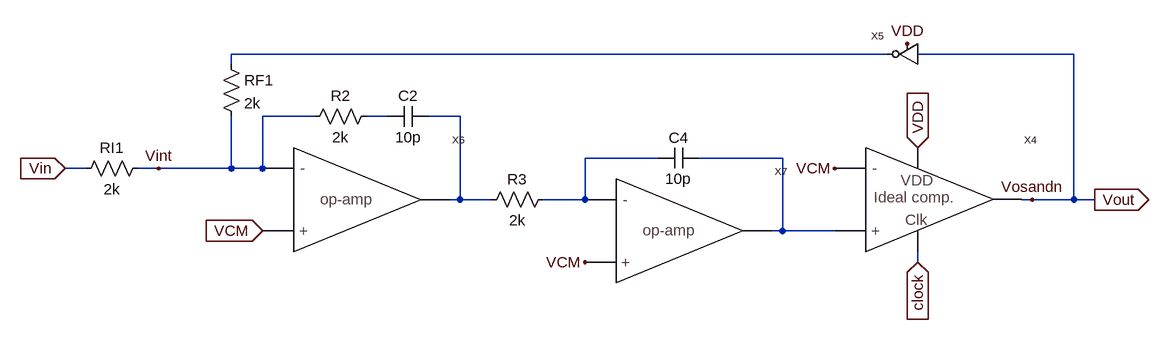
[diagram p0: schematic 1_bit_2nd_ANS_mod_MSD.asc]
1_bit_2nd_ANS_mod_MSD.asc, the LTspice schematic file:
Version 4
SHEET 1 912 680
WIRE 384 -720 -624 -720
WIRE 672 -720 432 -720
WIRE -624 -704 -624 -720
WIRE -496 -624 -576 -624
WIRE -384 -624 -416 -624
WIRE -272 -624 -320 -624
WIRE 32 -560 -80 -560
WIRE 224 -560 96 -560
WIRE -848 -544 -880 -544
WIRE -736 -544 -768 -544
WIRE -624 -544 -624 -624
WIRE -624 -544 -736 -544
WIRE -576 -544 -576 -624
WIRE -576 -544 -624 -544
WIRE -272 -496 -272 -624
WIRE -272 -496 -288 -496
WIRE -224 -496 -272 -496
WIRE -80 -496 -80 -560
WIRE -80 -496 -144 -496
WIRE 608 -496 592 -496
WIRE 672 -496 672 -720
WIRE 672 -496 608 -496
WIRE 704 -496 672 -496
WIRE 224 -448 224 -560
WIRE 224 -448 208 -448
WIRE 304 -448 224 -448
WIRE 432 -400 432 -416
FLAG 432 -576 VDD
IOPIN 432 -576 In
FLAG 432 -400 clock
IOPIN 432 -400 In
FLAG 704 -496 Vout
IOPIN 704 -496 Out
FLAG -880 -544 Vin
IOPIN -880 -544 In
FLAG -576 -448 VCM
IOPIN -576 -448 In
FLAG 608 -496 Vosandn
FLAG -736 -544 Vint
FLAG 304 -544 VCM
FLAG 416 -736 VDD
FLAG -80 -400 VCM
SYMBOL Ideal_clocked_comparator 352 -496 R0
SYMATTR InstName X4
SYMBOL cap -384 -608 R270
WINDOW 0 32 32 VTop 0
WINDOW 3 0 32 VBottom 0
SYMATTR InstName C2
SYMATTR Value 10p
SYMBOL res -752 -560 R90
WINDOW 0 0 56 VBottom 0
WINDOW 3 32 56 VTop 0
SYMATTR InstName RI1
SYMATTR Value 2k
SYMBOL res -640 -720 R0
SYMATTR InstName RF1
SYMATTR Value 2k
SYMBOL inverter 432 -720 M0
SYMATTR InstName X5
SYMBOL op_amp -528 -496 R0
SYMATTR InstName X6
SYMBOL cap 32 -544 R270
WINDOW 0 32 32 VTop 0
WINDOW 3 0 32 VBottom 0
SYMATTR InstName C4
SYMATTR Value 10p
SYMBOL op_amp -32 -448 R0
SYMATTR InstName X7
SYMBOL res -512 -608 R270
WINDOW 0 32 56 VTop 0
WINDOW 3 0 56 VBottom 0
SYMATTR InstName R2
SYMATTR Value 2k
SYMBOL res -240 -480 R270
WINDOW 0 32 56 VTop 0
WINDOW 3 0 56 VBottom 0
SYMATTR InstName R3
SYMATTR Value 2k

The netlist it stands for:
* 1_bit_2nd_ANS_mod_MSD.asc
XX4 VCM N005 Vosandn VDD clock Ideal_clocked_comparator  ; pins Vinm Vinp Vout VDD Clock
C2 N002 N003 10p
RI1 Vint Vin 2k
RF1 N001 Vint 2k
XX5 Vosandn N001 VDD inverter  ; pins In Out VDD
XX6 Vint VCM N003 op_amp  ; pins Vinm Vinp Out
C4 N004 N005 10p
XX7 N004 VCM N005 op_amp  ; pins Vinm Vinp Out
R2 Vint N002 2k
R3 N003 N004 2k
.backanno
.end